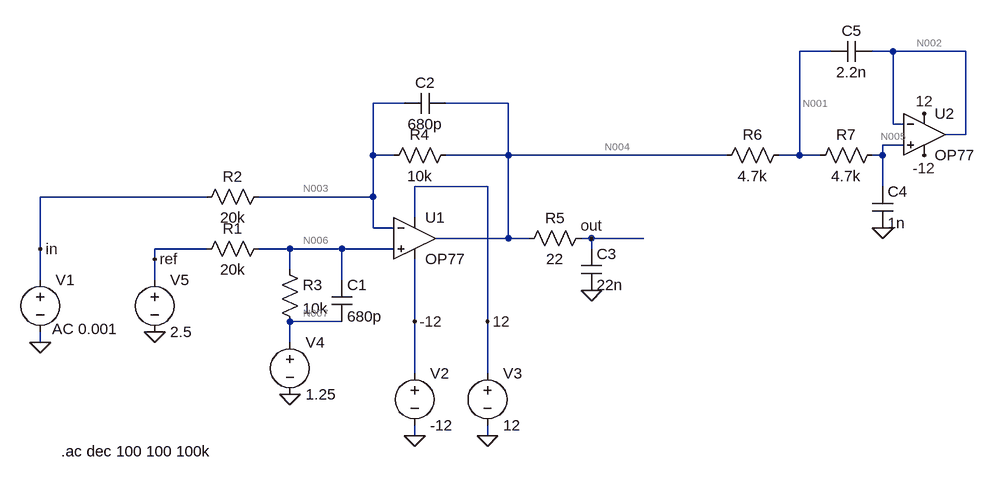
[diagram p0: schematic Draft1.asc]
Draft1.asc, the LTspice schematic file:
Version 4
SHEET 1 1456 680
WIRE 1232 -288 1184 -288
WIRE 1328 -288 1296 -288
WIRE 1440 -288 1328 -288
WIRE 576 -208 528 -208
WIRE 736 -208 640 -208
WIRE 1328 -176 1328 -288
WIRE 1344 -176 1328 -176
WIRE 1440 -160 1440 -288
WIRE 1440 -160 1408 -160
WIRE 1344 -144 1312 -144
WIRE 528 -128 528 -208
WIRE 560 -128 528 -128
WIRE 736 -128 736 -208
WIRE 736 -128 640 -128
WIRE 1072 -128 736 -128
WIRE 1184 -128 1184 -288
WIRE 1184 -128 1152 -128
WIRE 1216 -128 1184 -128
WIRE 1312 -128 1312 -144
WIRE 1312 -128 1296 -128
WIRE 704 -80 592 -80
WIRE 1312 -80 1312 -128
WIRE 272 -64 16 -64
WIRE 528 -64 528 -128
WIRE 528 -64 352 -64
WIRE 592 -32 592 -80
WIRE 528 -16 528 -64
WIRE 560 -16 528 -16
WIRE 736 0 736 -128
WIRE 736 0 624 0
WIRE 768 0 736 0
WIRE 864 0 848 0
WIRE 944 0 864 0
WIRE 16 16 16 -64
WIRE 272 16 192 16
WIRE 400 16 352 16
WIRE 480 16 400 16
WIRE 560 16 480 16
WIRE 864 16 864 0
WIRE 192 32 192 16
WIRE 400 48 400 16
WIRE 16 64 16 16
WIRE 192 64 192 32
WIRE 480 64 480 16
WIRE 480 128 400 128
WIRE 592 128 592 32
WIRE 704 128 704 -80
WIRE 16 160 16 144
WIRE 400 160 400 128
WIRE 592 208 592 128
WIRE 704 208 704 128
WIRE 592 304 592 288
WIRE 704 304 704 288
FLAG 16 160 0
FLAG 592 304 0
FLAG 704 304 0
FLAG 864 80 0
FLAG 864 0 out
FLAG 16 16 in
FLAG 704 128 12
FLAG 592 128 -12
FLAG 1376 -192 12
FLAG 1376 -128 -12
FLAG 1312 -16 0
FLAG 192 144 0
FLAG 400 240 0
FLAG 192 32 ref
SYMBOL voltage 16 48 R0
WINDOW 123 18 91 Left 2
WINDOW 39 0 0 Left 0
WINDOW 3 18 119 Left 2
SYMATTR Value2 AC 0.001
SYMATTR Value ""
SYMATTR InstName V1
SYMBOL res 368 0 R90
WINDOW 0 0 56 VBottom 2
WINDOW 3 32 56 VTop 2
SYMATTR InstName R1
SYMATTR Value 20k
SYMBOL res 368 -80 R90
WINDOW 0 0 56 VBottom 2
WINDOW 3 32 56 VTop 2
SYMATTR InstName R2
SYMATTR Value 20k
SYMBOL res 384 32 R0
SYMATTR InstName R3
SYMATTR Value 10k
SYMBOL cap 464 64 R0
SYMATTR InstName C1
SYMATTR Value 680p
SYMBOL OpAmps\\OP77 592 -64 R0
SYMATTR InstName U1
SYMBOL voltage 592 192 R0
WINDOW 123 0 0 Left 0
WINDOW 39 0 0 Left 0
SYMATTR InstName V2
SYMATTR Value -12
SYMBOL voltage 704 192 R0
WINDOW 123 0 0 Left 0
WINDOW 39 0 0 Left 0
SYMATTR InstName V3
SYMATTR Value 12
SYMBOL res 656 -144 R90
WINDOW 0 0 56 VBottom 2
WINDOW 3 32 56 VTop 2
SYMATTR InstName R4
SYMATTR Value 10k
SYMBOL cap 640 -224 R90
WINDOW 0 0 32 VBottom 2
WINDOW 3 32 32 VTop 2
SYMATTR InstName C2
SYMATTR Value 680p
SYMBOL res 864 -16 R90
WINDOW 0 0 56 VBottom 2
WINDOW 3 32 56 VTop 2
SYMATTR InstName R5
SYMATTR Value 22
SYMBOL cap 848 16 R0
SYMATTR InstName C3
SYMATTR Value 22n
SYMBOL res 1168 -144 R90
WINDOW 0 0 56 VBottom 2
WINDOW 3 32 56 VTop 2
SYMATTR InstName R6
SYMATTR Value 4.7k
SYMBOL res 1312 -144 R90
WINDOW 0 0 56 VBottom 2
WINDOW 3 32 56 VTop 2
SYMATTR InstName R7
SYMATTR Value 4.7k
SYMBOL cap 1296 -80 R0
SYMATTR InstName C4
SYMATTR Value 1n
SYMBOL cap 1296 -304 R90
WINDOW 0 0 32 VBottom 2
WINDOW 3 32 32 VTop 2
SYMATTR InstName C5
SYMATTR Value 2.2n
SYMBOL OpAmps\\OP77 1376 -224 R0
SYMATTR InstName U2
SYMBOL voltage 400 144 R0
WINDOW 123 0 0 Left 0
WINDOW 39 0 0 Left 0
SYMATTR InstName V4
SYMATTR Value 1.25
SYMBOL voltage 192 48 R0
WINDOW 123 0 0 Left 0
WINDOW 39 0 0 Left 0
SYMATTR InstName V5
SYMATTR Value 2.5
TEXT 48 328 Left 2 !.ac dec 100 100 100k

The netlist it stands for:
* Draft1.asc
V1 in 0 AC 0.001
R1 N006 ref 20k
R2 N003 in 20k
R3 N006 N007 10k
C1 N006 N007 680p
XU1 N006 N003 12 -12 N004 OP77  ; pins In+ In- V+ V- OUT
V2 -12 0 -12
V3 12 0 12
R4 N004 N003 10k
C2 N004 N003 680p
R5 out N004 22
C3 out 0 22n
R6 N001 N004 4.7k
R7 N005 N001 4.7k
C4 N005 0 1n
C5 N002 N001 2.2n
XU2 N005 N002 12 -12 N002 OP77  ; pins In+ In- V+ V- OUT
V4 N007 0 1.25
V5 ref 0 2.5
.ac dec 100 100 100k
.lib ADI.lib
.backanno
.end

* Results of the author's LTspice run, read from the files saved beside the schematic
* Operating Point, zero values left out:
*   V(n006) = 1.667 V
*   V(ref) = 2.5 V
*   V(n003) = 1.667 V
*   V(n007) = 1.25 V
*   V(12) = 12 V
*   V(-12) = -12 V
*   V(n004) = 2.5 V
*   V(out) = 2.5 V
*   V(n001) = 2.5 V
*   V(n005) = 2.5 V
*   V(n002) = 2.5 V
*   I(R1) = -41.67 µA
*   I(R2) = 83.33 µA
*   I(R3) = 41.67 µA
*   I(R4) = 83.33 µA
*   I(R6) = -1.341 nA
*   I(R7) = -1.341 nA
*   I(V1) = 83.33 µA
*   I(V2) = 2.69 mA
*   I(V3) = -2.773 mA
*   I(V4) = 41.67 µA
*   I(V5) = -41.67 µA
*   Ix(u1:1) = 1.34 nA
*   Ix(u1:2) = 1.04 nA
*   Ix(u1:99) = 1.428 mA
*   Ix(u1:50) = -1.345 mA
*   Ix(u1:39) = -83.34 µA
*   Ix(u2:1) = 1.341 nA
*   Ix(u2:2) = 1.041 nA
*   Ix(u2:99) = 1.345 mA
*   Ix(u2:50) = -1.345 mA
*   Ix(u2:39) = -1.041 nA
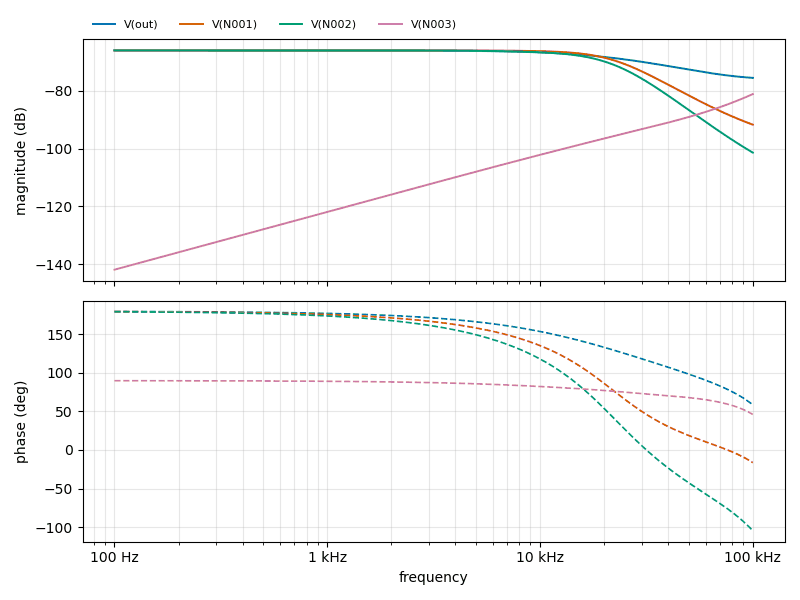
[diagram p1: AC Analysis of Draft1.asc, plotted from the saved traces]
* AC Analysis, 1 run:
*   V(out): -66.02 dB at 100 Hz, -75.52 dB at 100 kHz, peak -66.02 dB at 100 Hz, 3 dB below the peak at 24.41 kHz
*   V(N001): -66.02 dB at 100 Hz, -91.72 dB at 100 kHz, peak -66.02 dB at 100 Hz, 3 dB below the peak at 21.25 kHz
*   V(N002): -66.02 dB at 100 Hz, -101.38 dB at 100 kHz, peak -66.02 dB at 100 Hz, 3 dB below the peak at 18.32 kHz
*   V(N003): -141.88 dB at 100 Hz, -81.14 dB at 100 kHz, peak -81.14 dB at 100 kHz, 3 dB below the peak at 79.61 kHz